# Altium project HANDS_FREE_Power_Manager_V1.PrjPCB
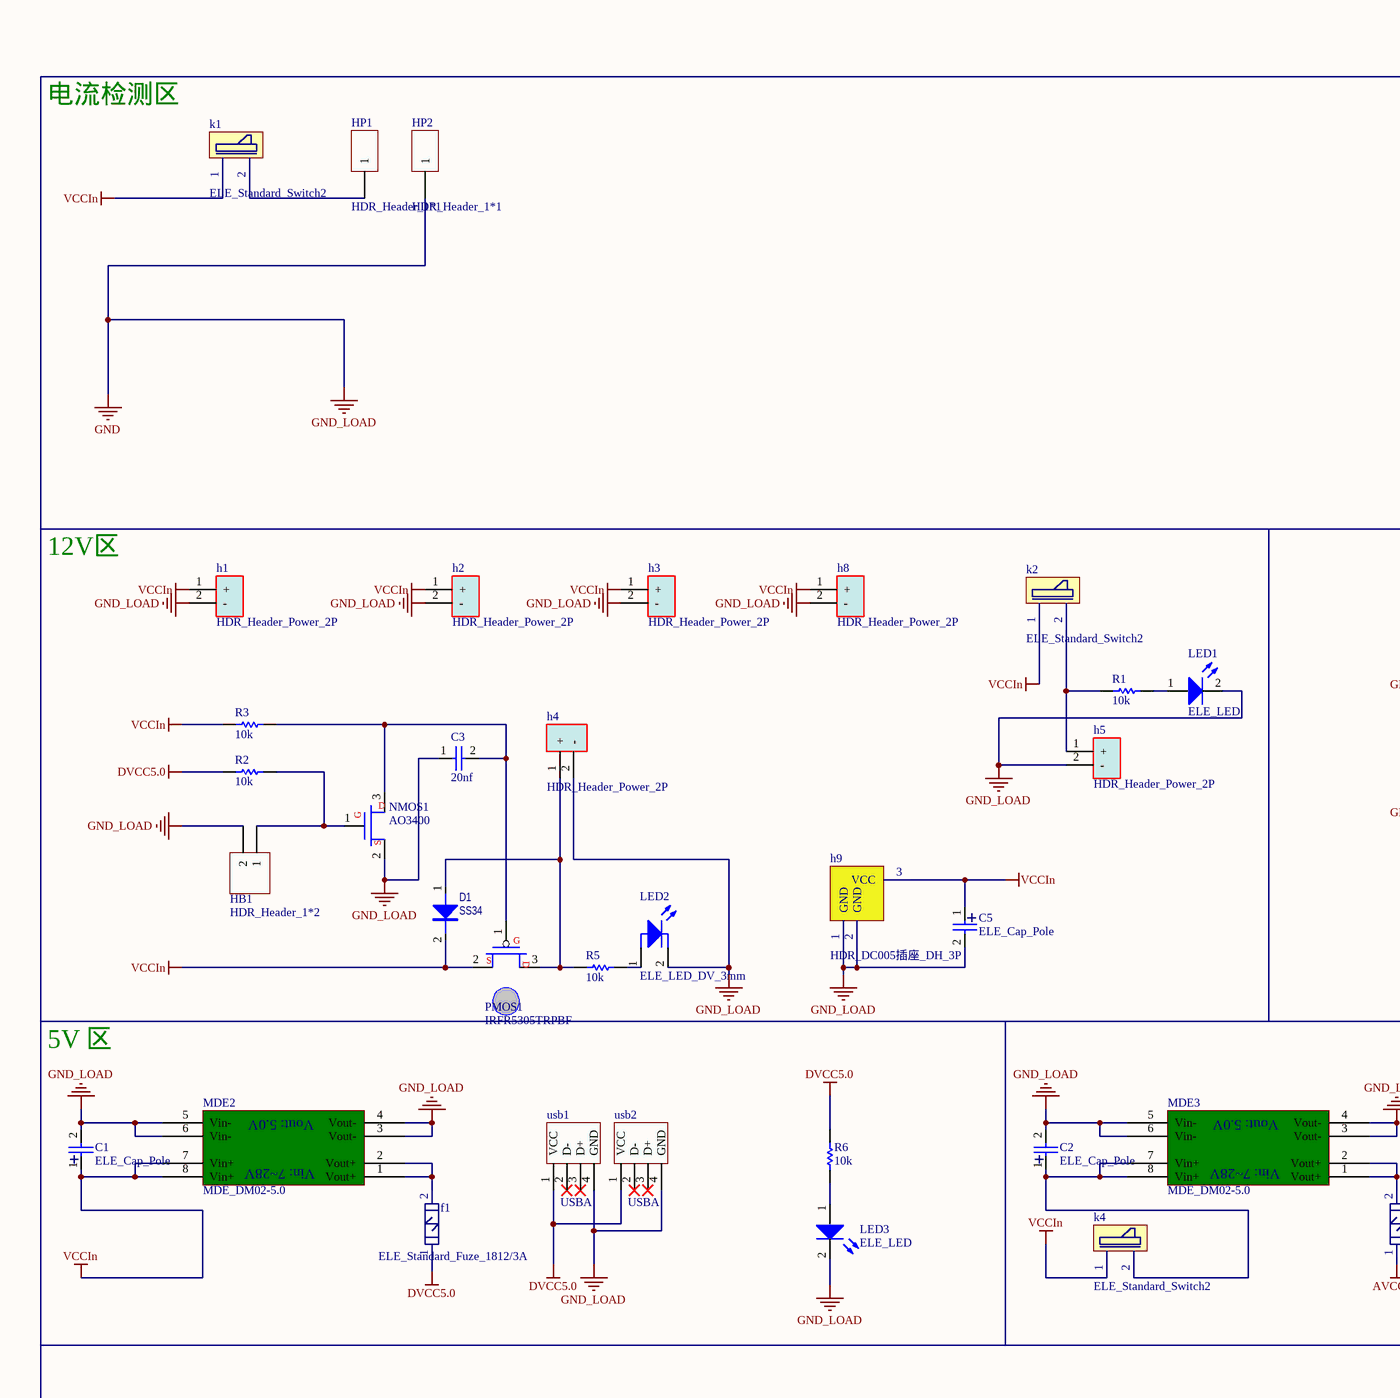
[diagram p0: HANDS_FREE_Power_Manager_V1.SchDoc, left]
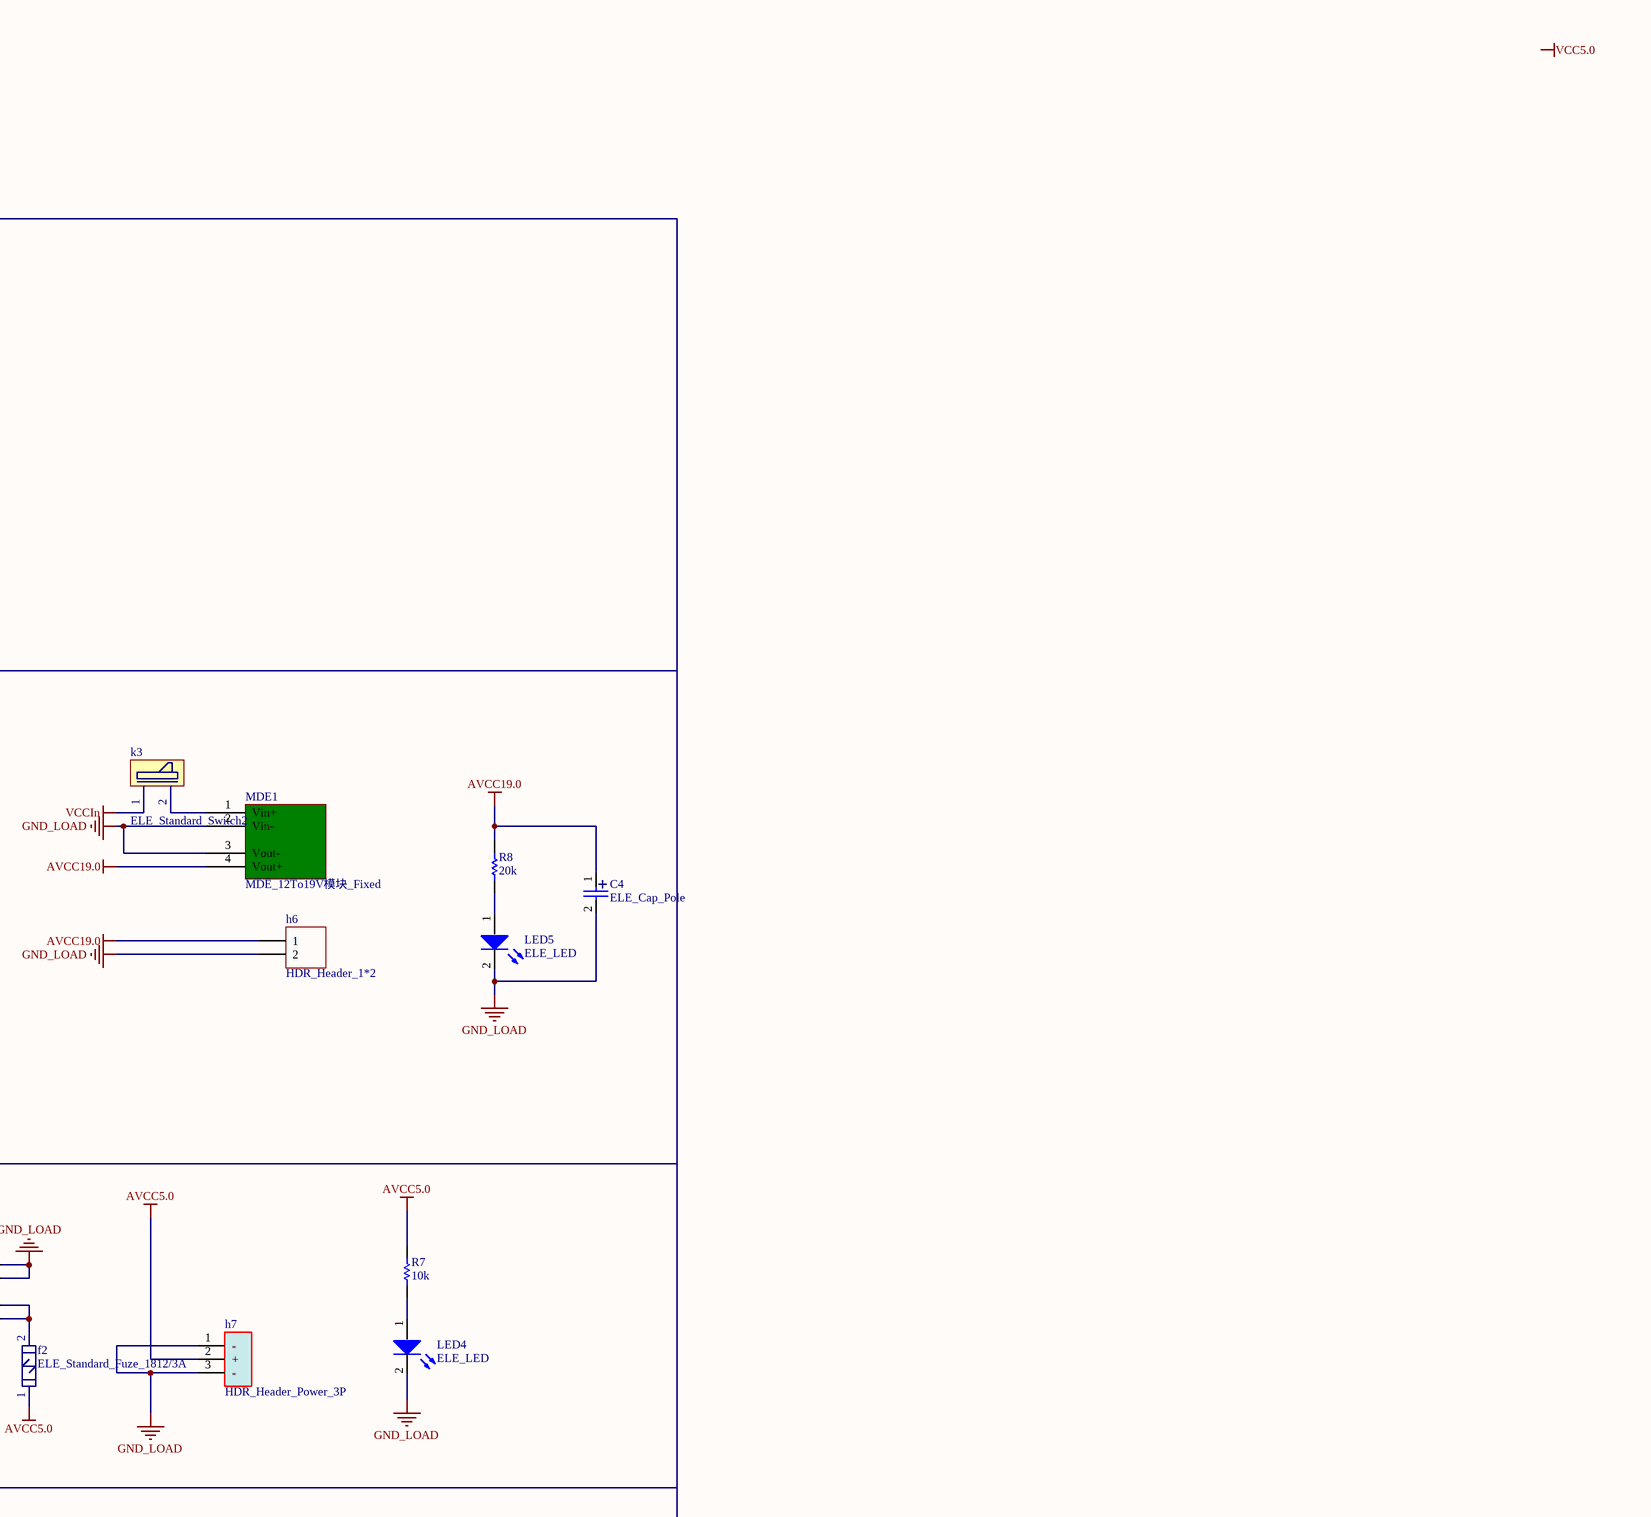
[diagram p1: HANDS_FREE_Power_Manager_V1.SchDoc, right]
1 sheet, 43 parts. Net scope: global (net labels, ports and power ports of the same name join across sheets).
Board file: HANDS_FREE_Power_Manager_V1.PcbDoc

## Sheet HANDS_FREE_Power_Manager_V1.SchDoc
size A1

### Parts
C1  ELE_Cap_Pole  [ELE_铝解电容_PV_6.3]
C2  ELE_Cap_Pole  [ELE_铝解电容_PV_6.3]
C3  20nf  [ELE_0603_P]
C4  ELE_Cap_Pole  [ELE_铝解电容_PV_6.3]
C5  ELE_Cap_Pole  [ELE_铝解电容_PV_6.3]
D1  SS34  [ELE_D1206]
f1  ELE_Standard_Fuze_1812/3A  [ELE_FUZE_1812]
f2  ELE_Standard_Fuze_1812/3A  [ELE_FUZE_1812]
h1  HDR_Header_Power_2P  [HDR_MOLEX_POWER5557_DH_2P]
h2  HDR_Header_Power_2P  [HDR_MOLEX_POWER5557_DH_2P]
h3  HDR_Header_Power_2P  [HDR_MOLEX_POWER5557_DH_2P]
h4  HDR_Header_Power_2P  [HDR_MOLEX_POWER5557_DH_2P]
h5  HDR_Header_Power_2P  [HDR_MOLEX_CANMX3.0_DH_2P]
h6  HDR_Header_1*2  [HDR_KF300_DH_2P]
h7  HDR_Header_Power_3P  [HDR_Header_XH2.54_DH_1*3]
h8  HDR_Header_Power_2P  [HDR_MOLEX_POWER5557_DH_2P]
h9  HDR_DC005插座_DH_3P  [ELE_DC005插座_DV]
HB1  HDR_Header_1*2  [HDR_Header_2.00_DH_1*2]
HP1  HDR_Header_1*1  [HDR_H_DH_1P]
HP2  HDR_Header_1*1  [HDR_H_DH_1P]
k1  ELE_Standard_Switch2  [ELE_船型开关2_D]
k2  ELE_Standard_Switch2  [ELE_船型开关1_D]
k3  ELE_Standard_Switch2  [ELE_船型开关1_D]
k4  ELE_Standard_Switch2  [ELE_船型开关1_D]
LED1  ELE_LED  [ELE_0603极性_P]
LED2  ELE_LED_DV_3mm  [ELE_LED_DV]
LED3  ELE_LED  [ELE_0603极性_P]
LED4  ELE_LED  [ELE_0603极性_P]
LED5  ELE_LED  [ELE_0603极性_P]
MDE1  MDE_12To19V模块_Fixed  [MDE_12To19V模块_Fixed]
MDE2  MDE_DM02-5.0  [MDE_DM02-5.0]
MDE3  MDE_DM02-5.0  [MDE_DM02-5.0]
NMOS1  AO3400  [CHP_SOT23_P_3P]
PMOS1  IRFR5305TRPBF  [CHP_TOD252]
R1  10k  [ELE_0603_P]
R2  10k  [ELE_0603_P]
R3  10k  [ELE_0603_P]
R5  10k  [ELE_0603_P]
R6  10k  [ELE_0603_P]
R7  10k  [ELE_0603_P]
R8  20k  [ELE_0603_P]
usb1  USBA  [HDR_USBA_DH]
usb2  USBA  [HDR_USBA_DH]

### Nets
AVCC5.0: f2.1 h7.2(+) R7.2
AVCC19.0: C4.1 h6.1 MDE1.4(Vout+) R8.2
DVCC5.0: f1.1 R2.1 R6.2 usb1.1(VCC) usb2.1(VCC)
GND: C1.2 C2.2 C3.1 C4.2 C5.2 h1.2(-) h2.2(-) h3.2(-) h4.2(-) h5.2(-) h6.2 h7.1(-) h7.3(-) h8.2(-) h9.1(GND) h9.2(GND) HB1.2 HP2.1 LED1.2 LED2.2 LED3.2 LED4.2 LED5.2 MDE1.2(Vin-) MDE1.3(Vout-) MDE2.3(Vout-) MDE2.4(Vout-) MDE2.5(Vin-) MDE2.6(Vin-) MDE3.3(Vout-) MDE3.4(Vout-) MDE3.5(Vin-) MDE3.6(Vin-) NMOS1.2(S) usb1.4(GND) usb2.4(GND)  [also labelled GND_LOAD]
VCCIn: C1.1 C5.1 D1.2 h1.1(+) h2.1(+) h3.1(+) h8.1(+) h9.3(VCC) k1.1 k2.1 k3.1 k4.1 MDE2.7(Vin+) MDE2.8(Vin+) PMOS1.2(S) R3.1
NetC2_1: C2.1 k4.2 MDE3.7(Vin+) MDE3.8(Vin+)
NetC3_2: C3.2 NMOS1.3(D) PMOS1.1(G) R3.2
NetD1_1: D1.1 h4.1(+) PMOS1.3(D) R5.1
Netf1_2: f1.2 MDE2.1(Vout+) MDE2.2(Vout+)
Netf2_2: f2.2 MDE3.1(Vout+) MDE3.2(Vout+)
Neth5_1: h5.1(+) k2.2 R1.1
NetHB1_1: HB1.1 NMOS1.1(G) R2.2
NetHP1_1: HP1.1 k1.2
Netk3_2: k3.2 MDE1.1(Vin+)
NetLED1_1: LED1.1 R1.2
NetLED2_1: LED2.1 R5.2
NetLED3_1: LED3.1 R6.1
NetLED4_1: LED4.1 R7.1
NetLED5_1: LED5.1 R8.1

Not connected (* = marked no-connect by the designer): usb1 2(D-)* 3(D+)*; usb2 2(D-)* 3(D+)*

### Notes on the sheet
- 电流检测区
- 12V区
- 5V 区
- Labels drawn without touching a wire or pin: VCC5.0
- (in symbol MDE_DM02-5.0) Vout: 5.0V; Vin: 7~28V

### Library data of the parts
C1 C2 C4 C5 = ELE_Cap_Pole: 贴片 极性电容 0603
C3 = ELE_Cap: 贴片 电容 0603
D1 = ELE_Diode: 贴片 二极管 1206
f1 f2 = ELE_Standard_Fuze_1812/3A: 贴片保险丝 1812 3A
h1-h5 h8 = HDR_Header_Power_2P: 直插 5557接头 1*2P
h7 = HDR_Header_Power_3P: 5V专用 直插 XH2.54 3P接头
h9 = HDR_DC005插座_DH_3P: 直插 DC5.0接头
k1-k4 = ELE_Standard_Switch2: 直插 船型开关 2脚 8.5*13.5mm
LED1 LED3-LED5 = ELE_LED: 发光二极管 0603; Published: 8-Jun-2000; LatestRevisionDate: 17-Jul-2002; LatestRevisionNote: Re-released for DXP Platform.; PackageDocument: Feb-2002; PackageReference: 3.2X1.6X1.1; Publisher: Altium Limited
LED2 = ELE_LED_DV_3mm: 发光二极管 直插 3mm; Published: 8-Jun-2000; LatestRevisionDate: 17-Jul-2002; LatestRevisionNote: Re-released for DXP Platform.; PackageDocument: Feb-2002; PackageReference: 3.2X1.6X1.1; Publisher: Altium Limited
MDE1 = MDE_12To19V模块_Fixed: 19V升压模块， 车载电源模块。
NMOS1 = ELE_NMOS_1: 贴片 NMOS管 SOT23; Note: Pin 2 is electrically connected to pin 4.; Published: 8-Jun-2000; LatestRevisionDate: 17-Jul-2002; LatestRevisionNote: Re-released for DXP Platform.; DatasheetDocument: PD-9.814; PackageReference: TO-220AB; Publisher: Altium Limited; Code_JEDEC: TO-220-AB; ComponentLink1Description: Manufacturer Link; ComponentLink1URL: http://www.irf.com/
PMOS1 = ELE_PMOS_1: 贴片 PMOS管 SOT23; Note: Pin 2 is electrically connected to pin 4.; Published: 8-Jun-2000; LatestRevisionDate: 17-Jul-2002; LatestRevisionNote: Re-released for DXP Platform.; DatasheetDocument: PD-9.814; PackageReference: TO-220AB; Publisher: Altium Limited; Code_JEDEC: TO-220-AB; ComponentLink1Description: Manufacturer Link; ComponentLink1URL: http://www.irf.com/
R1-R3 R5-R8 = ELE_Standard_R50R: 贴片 电阻50欧 0603
usb1 usb2 = HDR_USB_HOST: 直插 USB头
h6 HB1 = HDR_Header_1*2: LatestRevisionDate: 17-Jul-2002; LatestRevisionNote: Re-released for DXP Platform.; Publisher: Altium Limited
HP1 HP2 = HDR_Header_1*1: LatestRevisionDate: 17-Jul-2002; LatestRevisionNote: Re-released for DXP Platform.; Publisher: Altium Limited